# EAGLE schematic BikeBikeAja|V2 (EAGLE 9.6.2)

## Sheet 1 of 4
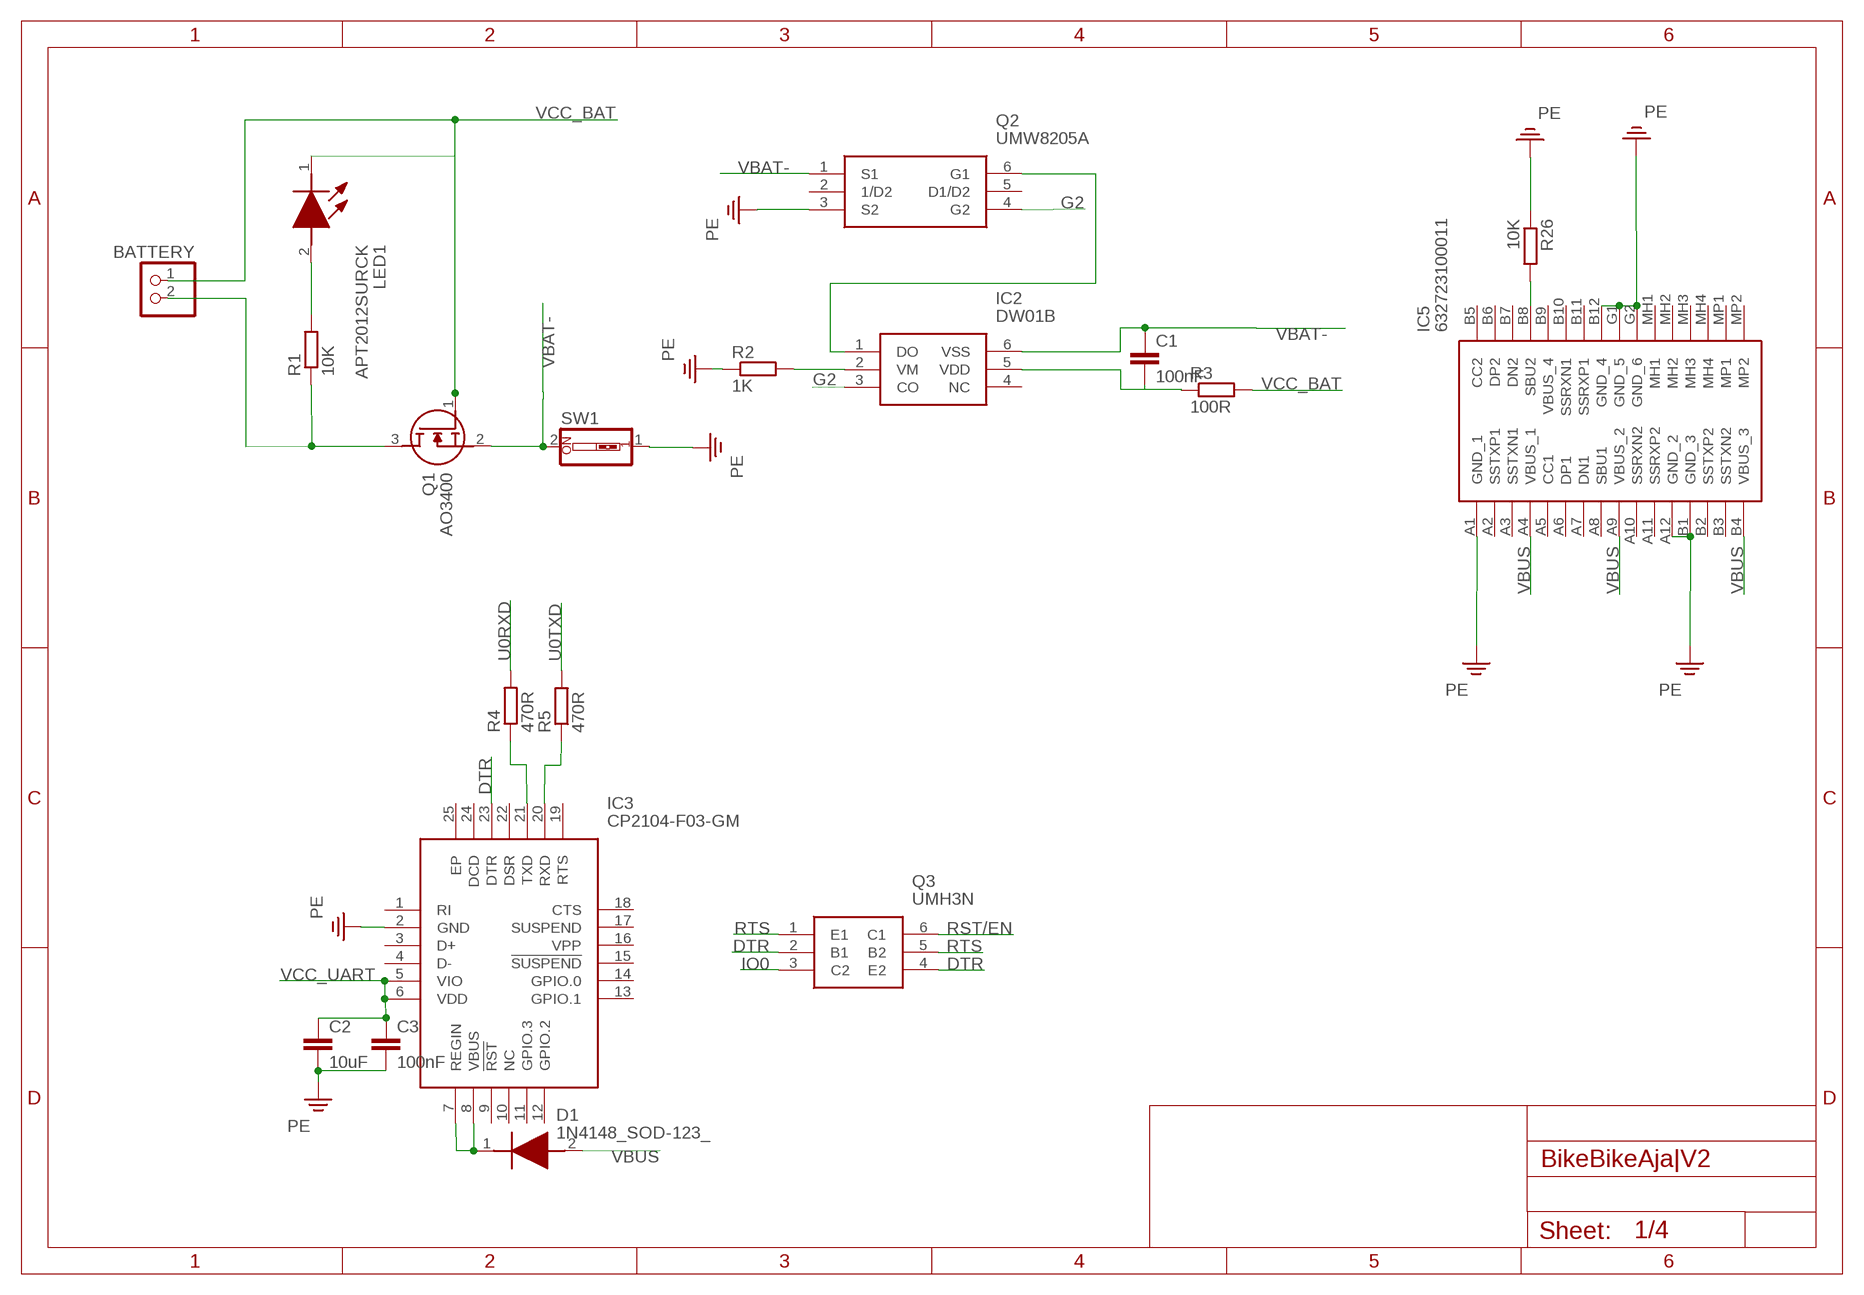
[diagram p0: schematic, sheet 1]

### Parts
BATTERY  PINHD-1X2  [1X02]
C1  100nF  C-EUC1206  [C1206]
C2  10uF  C-EUC1206  [C1206]
C3  100nF  C-EUC1206  [C1206]
D1  1N4148_SOD-123_  [SOD3716X135N]
IC2  DW01B  [SOT95P280X145-6N]
IC3  CP2104-F03-GM  [QFN50P400X400X80-25N]
IC5  632723100011  [632723100011]
LED1  APT2012SURCK  [LEDC2012X85N]
Q1  AO3400  [SOT95P280X125-3N]
Q2  UMW8205A  [SOT95P285X140-6N]
Q3  UMH3N  [SOT65P230X110-6N]
R1  10K  R-EU_R0805  [R0805]
R2  1K  R-EU_R0805  [R0805]
R3  100R  R-EU_R0805  [R0805]
R4  470R  R-EU_R0805  [R0805]
R5  470R  R-EU_R0805  [R0805]
R26  10K  R-EU_R0805  [R0805]
SW1  SW_DIP-1  [EDG-01]

### Nets
DTR: IC3.23(DTR) Q3.2(B1) Q3.4(E2)
G2: IC2.3(CO) Q2.4(G2)
IO0: Q3.3(C2) ; also sheet 3
N$1: LED1.2(A) R1.2
N$2: BATTERY.1 LED1.1(K) Q1.1(G)
N$3: BATTERY.2 Q1.3(D) R1.1
N$4: Q1.2(S) SW1.2
N$5: IC2.1(DO) Q2.6(G1)
N$6: C1.1 IC2.6(VSS)
N$7: C1.2 IC2.5(VDD) R3.1
N$9: IC2.2(VM) R2.2
N$10: D1.1(K) IC3.7(REGIN) IC3.8(VBUS)
N$11: IC3.21(TXD) R4.1
N$12: IC3.20(RXD) R5.1
N$14: IC5.B8(SBU2) R26.2
PE: C2.2 C3.2 IC3.2(GND) IC5.A1(GND_1) IC5.A12(GND_2) IC5.B1(GND_3) IC5.B12(GND_4) IC5.G1(GND_5) IC5.G2(GND_6) Q2.3(S2) R2.1 R26.1 SW1.1 ; also sheet 2,3,4
RST/EN: Q3.6(C1) ; also sheet 3
RTS: Q3.1(E1) Q3.5(B2)
U0RXD: R4.2 ; also sheet 3
U0TXD: R5.2 ; also sheet 3
VBAT-: Q2.1(S1)
VBUS: D1.2(A) IC5.A4(VBUS_1) IC5.A9(VBUS_2) IC5.B4(VBUS_3) ; also sheet 4
VCC_BAT: R3.2
VCC_UART: C2.1 C3.1 IC3.5(VIO) IC3.6(VDD)
Unconnected: IC2.4(NC) IC3.1(RI) IC3.3(D+) IC3.4(D-) IC3.9(!RST) IC3.10(NC) IC3.11(GPIO.3) IC3.12(GPIO.2) IC3.13(GPIO.1) IC3.14(GPIO.0) IC3.15(!SUSPEND) IC3.16(VPP) IC3.17(SUSPEND) IC3.18(CTS) IC3.19(RTS) IC3.22(DSR) IC3.24(DCD) IC3.25(EP) IC5.A2(SSTXP1) IC5.A3(SSTXN1) IC5.A5(CC1) IC5.A6(DP1) IC5.A7(DN1) IC5.A8(SBU1) IC5.A10(SSRXN2) IC5.A11(SSRXP2) IC5.B2(SSTXP2) IC5.B3(SSTXN2) IC5.B5(CC2) IC5.B6(DP2) IC5.B7(DN2) IC5.B9(VBUS_4) IC5.B10(SSRXN1) IC5.B11(SSRXP1) IC5.MH1 IC5.MH2 IC5.MH3 IC5.MH4 IC5.MP1 IC5.MP2 Q2.2(1/D2) Q2.5(D1/D2)

## Sheet 2 of 4
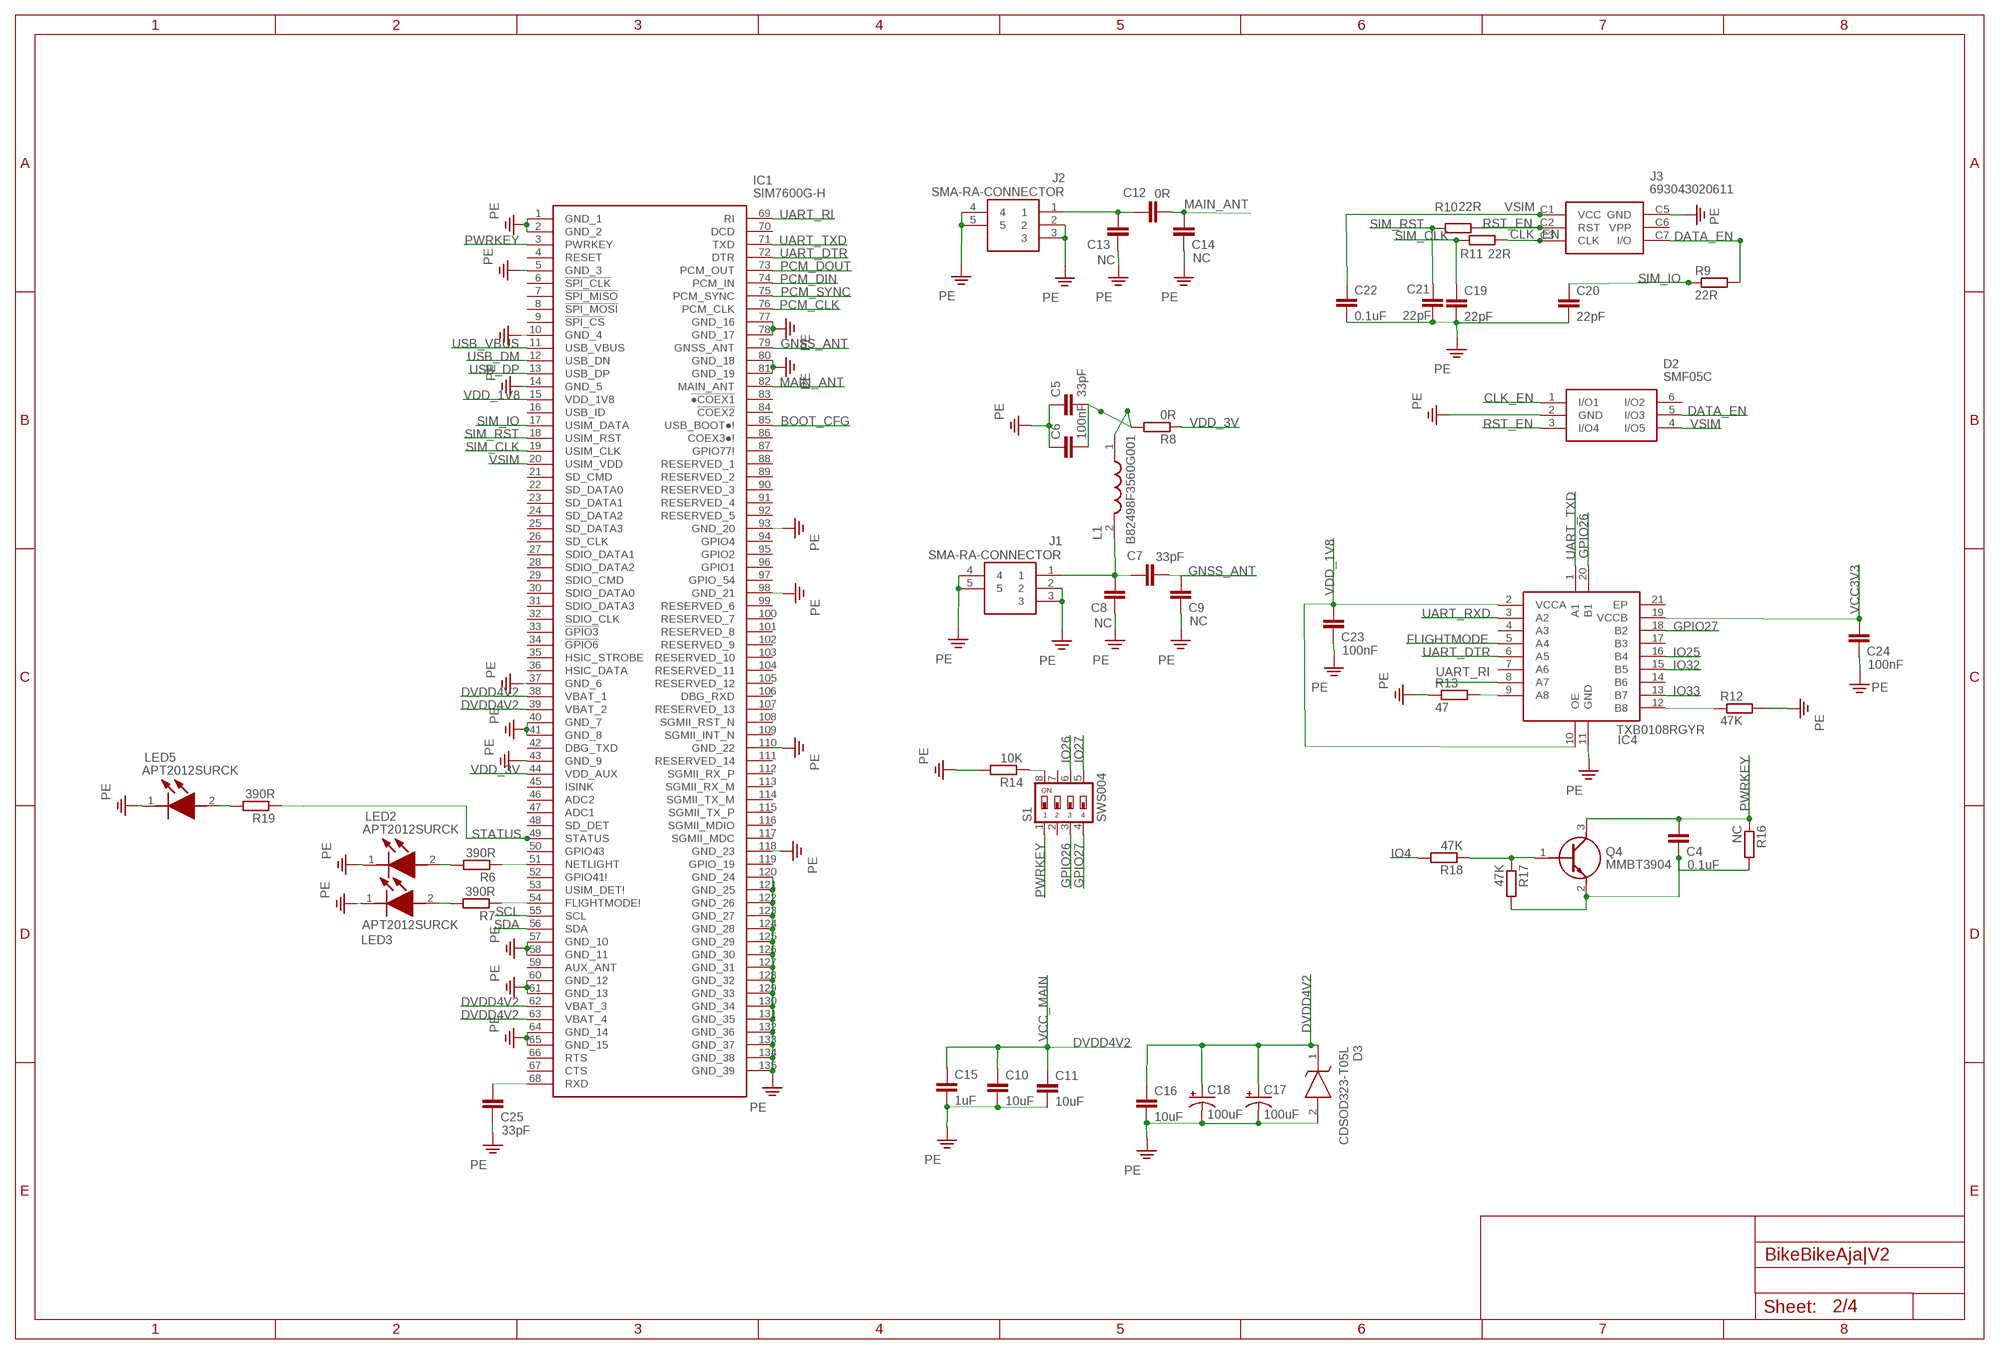
[diagram p1: schematic, sheet 2]

### Parts
C4  0.1uF  C-EUC1206  [C1206]
C5  33pF  C-EUC1206  [C1206]
C6  100nF  C-EUC1206  [C1206]
C7  33pF  C-EUC1206  [C1206]
C8  NC  C-EUC1206  [C1206]
C9  NC  C-EUC1206  [C1206]
C10  10uF  C-EUC1206  [C1206]
C11  10uF  C-EUC1206  [C1206]
C12  0R  C-EUC1206  [C1206]
C13  NC  C-EUC1206  [C1206]
C14  NC  C-EUC1206  [C1206]
C15  1uF  C-EUC1206  [C1206]
C16  10uF  C-EUC1206  [C1206]
C17  100uF  CPOL-USA/3216-18W  [A/3216-18W]
C18  100uF  CPOL-USA/3216-18W  [A/3216-18W]
C19  22pF  C-EUC1206  [C1206]
C20  22pF  C-EUC1206  [C1206]
C21  22pF  C-EUC1206  [C1206]
C22  0.1uF  C-EUC1206  [C1206]
C23  100nF  C-EUC1206  [C1206]
C24  100nF  C-EUC1206  [C1206]
C25  33pF  C-EUC1206  [C1206]
D2  SMF05C  [SOT65P210X110-6N]
D3  CDSOD323-T05L  [SOD2513X114N]
IC1  SIM7600G-H  [SIM7600GH]
IC4  TXB0108RGYR  [SN74LVC541ARGYR]
J1  SMA-RA-CONNECTOR  [SMARACONNECTOR]
J2  SMA-RA-CONNECTOR  [SMARACONNECTOR]
J3  693043020611  [693043020611]
L1  B82498F3560G001  [B82498F]
LED2  APT2012SURCK  [LEDC2012X85N]
LED3  APT2012SURCK  [LEDC2012X85N]
LED5  APT2012SURCK  [LEDC2012X85N]
Q4  MMBT3904  [SOT95P240X120-3N]
R6  390R  R-EU_R0805  [R0805]
R7  390R  R-EU_R0805  [R0805]
R8  0R  R-EU_R0805  [R0805]
R9  22R  R-EU_R0805  [R0805]
R10  22R  R-EU_R0805  [R0805]
R11  22R  R-EU_R0805  [R0805]
R12  47K  R-EU_R0805  [R0805]
R13  47  R-EU_R0805  [R0805]
R14  10K  R-EU_R0805  [R0805]
R16  NC  R-EU_R0805  [R0805]
R17  47K  R-EU_R0805  [R0805]
R18  47K  R-EU_R0805  [R0805]
R19  390R  R-EU_R0805  [R0805]
S1  SWS004  [SMS-004]

### Nets
BOOT_CFG: IC1.85(USB_BOOT●!)
CLK_EN: D2.1(I/O1) J3.C3(CLK) R11.1
DATA_EN: D2.5(I/O3) J3.C7(I/O)
DVDD4V2: IC1.38(VBAT_1) IC1.39(VBAT_2) IC1.62(VBAT_3) IC1.63(VBAT_4) ; also sheet 4
FLIGHTMODE: IC4.5(A4)
GNSS_ANT: IC1.79(GNSS_ANT)
GPIO26: IC4.20(B1) S1.3
GPIO27: IC4.18(B2) S1.4
IO4: R18.2 ; also sheet 3
IO25: IC4.16(B4) ; also sheet 3
IO26: S1.6 ; also sheet 3
IO27: S1.5 ; also sheet 3
IO32: IC4.15(B5) ; also sheet 3
IO33: IC4.13(B7) ; also sheet 3
MAIN_ANT: C12.2 C14.2 IC1.82(MAIN_ANT)
N$20: IC1.51(NETLIGHT) R6.1
N$21: LED2.2(A) R6.2
N$22: LED3.2(A) R7.2
N$23: IC1.54(FLIGHTMODE!) R7.1
N$24: C5.1 C6.1
N$26: C5.2 C6.2 L1.1 R8.2
N$28: C7.1 C8.2 J1.1 L1.2
N$29: C7.2 C9.2
N$30: C10.1 C11.1 C15.1
N$31: R9.2
N$32: C16.1 C17.+ C18.+ D3.1(K)
N$34: C12.1 C13.2 J2.1
N$35: IC4.12(B8) R12.1
N$36: IC4.9(A8) R13.2
N$37: R14.1 S1.8
N$39: C25.2 IC1.68(RXD)
N$40: Q4.1(B) R17.1 R18.1
N$41: C4.1 Q4.2(E) R16.2 R17.2
N$42: LED5.2(A) R19.2
PCM_CLK: IC1.76(PCM_CLK)
PCM_DIN: IC1.74(PCM_IN)
PCM_DOUT: IC1.73(PCM_OUT)
PCM_SYNC: IC1.75(PCM_SYNC)
PE: C8.1 C9.1 C10.2 C11.2 C13.1 C14.1 C15.2 C16.2 C17.- C18.- C19.2 C20.2 C21.2 C22.2 C23.1 C24.1 C25.1 D2.2(GND) D3.2(A) IC1.1(GND_1) IC1.2(GND_2) IC1.5(GND_3) IC1.10(GND_4) IC1.14(GND_5) IC1.37(GND_6) IC1.40(GND_7) IC1.41(GND_8) IC1.43(GND_9) IC1.57(GND_10) IC1.58(GND_11) IC1.60(GND_12) IC1.61(GND_13) IC1.64(GND_14) IC1.65(GND_15) IC1.77(GND_16) IC1.78(GND_17) IC1.80(GND_18) IC1.81(GND_19) IC1.93(GND_20) IC1.98(GND_21) IC1.110(GND_22) IC1.118(GND_23) IC1.120(GND_24) IC1.121(GND_25) IC1.122(GND_26) IC1.123(GND_27) IC1.124(GND_28) IC1.125(GND_29) IC1.126(GND_30) IC1.127(GND_31) IC1.128(GND_32) IC1.129(GND_33) IC1.130(GND_34) IC1.131(GND_35) IC1.132(GND_36) IC1.133(GND_37) IC1.134(GND_38) IC1.135(GND_39) IC4.11(GND) J1.2 J1.3 J1.4 J1.5 J2.2 J2.3 J2.4 J2.5 J3.C5(GND) LED2.1(K) LED3.1(K) LED5.1(K) R12.2 R13.1 R14.2 ; also sheet 1,3,4
PWRKEY: C4.2 IC1.3(PWRKEY) Q4.3(C) R16.1 S1.1
RST_EN: D2.3(I/O4) J3.C2(RST) R10.1
SCL: IC1.55(SCL)
SDA: IC1.56(SDA)
SIM_CLK: C19.1 IC1.19(USIM_CLK) R11.2
SIM_IO: C20.1 IC1.17(USIM_DATA) R9.1
SIM_RST: C21.1 IC1.18(USIM_RST) R10.2
STATUS: IC1.49(STATUS) R19.1
UART_DTR: IC1.72(DTR) IC4.6(A5)
UART_RI: IC1.69(RI) IC4.8(A7)
UART_RXD: IC4.3(A2)
UART_TXD: IC1.71(TXD) IC4.1(A1)
USB_DM: IC1.12(USB_DN)
USB_DP: IC1.13(USB_DP)
USB_VBUS: IC1.11(USB_VBUS)
VCC3V3: C24.2 IC4.19(VCCB) ; also sheet 3,4
VDD_1V8: C23.2 IC1.15(VDD_1V8) IC4.2(VCCA) IC4.10(OE)
VDD_3V: IC1.44(VDD_AUX) R8.1
VSIM: C22.1 D2.4(I/O5) IC1.20(USIM_VDD) J3.C1(VCC)
Unconnected: D2.6(I/O2) IC1.4(RESET) IC1.6(!SPI_CLK) IC1.7(!SPI_MISO) IC1.8(!SPI_MOSI) IC1.9(!SPI_CS) IC1.16(USB_ID) IC1.21(SD_CMD) IC1.22(SD_DATA0) IC1.23(SD_DATA1) IC1.24(SD_DATA2) IC1.25(SD_DATA3) IC1.26(SD_CLK) IC1.27(SDIO_DATA1) IC1.28(SDIO_DATA2) IC1.29(SDIO_CMD) IC1.30(SDIO_DATA0) IC1.31(SDIO_DATA3) IC1.32(SDIO_CLK) IC1.33(!GPIO3) IC1.34(!GPIO6) IC1.35(HSIC_STROBE) IC1.36(HSIC_DATA) IC1.42(DBG_TXD) IC1.45(ISINK) IC1.46(ADC2) IC1.47(ADC1) IC1.48(SD_DET) IC1.50(GPIO43) IC1.52(GPIO41!) IC1.53(USIM_DET!) IC1.59(AUX_ANT) IC1.66(RTS) IC1.67(CTS) IC1.70(DCD) IC1.83(!●COEX1) IC1.84(!COEX2) IC1.86(COEX3●!) IC1.87(GPIO77!) IC1.88(RESERVED_1) IC1.89(RESERVED_2) IC1.90(RESERVED_3) IC1.91(RESERVED_4) IC1.92(RESERVED_5) IC1.94(GPIO4) IC1.95(GPIO2) IC1.96(GPIO1) IC1.97(GPIO_54) IC1.99(RESERVED_6) IC1.100(RESERVED_7) IC1.101(RESERVED_8) IC1.102(RESERVED_9) IC1.103(RESERVED_10) IC1.104(RESERVED_11) IC1.105(RESERVED_12) IC1.106(DBG_RXD) IC1.107(RESERVED_13) IC1.108(SGMII_RST_N) IC1.109(SGMII_INT_N) IC1.111(RESERVED_14) IC1.112(SGMII_RX_P) IC1.113(SGMII_RX_M) IC1.114(SGMII_TX_M) IC1.115(SGMII_TX_P) IC1.116(SGMII_MDIO) IC1.117(SGMII_MDC) IC1.119(GPIO_19) IC4.4(A3) IC4.7(A6) IC4.14(B6) IC4.17(B3) IC4.21(EP) J3.C6(VPP) S1.2 S1.7

## Sheet 3 of 4
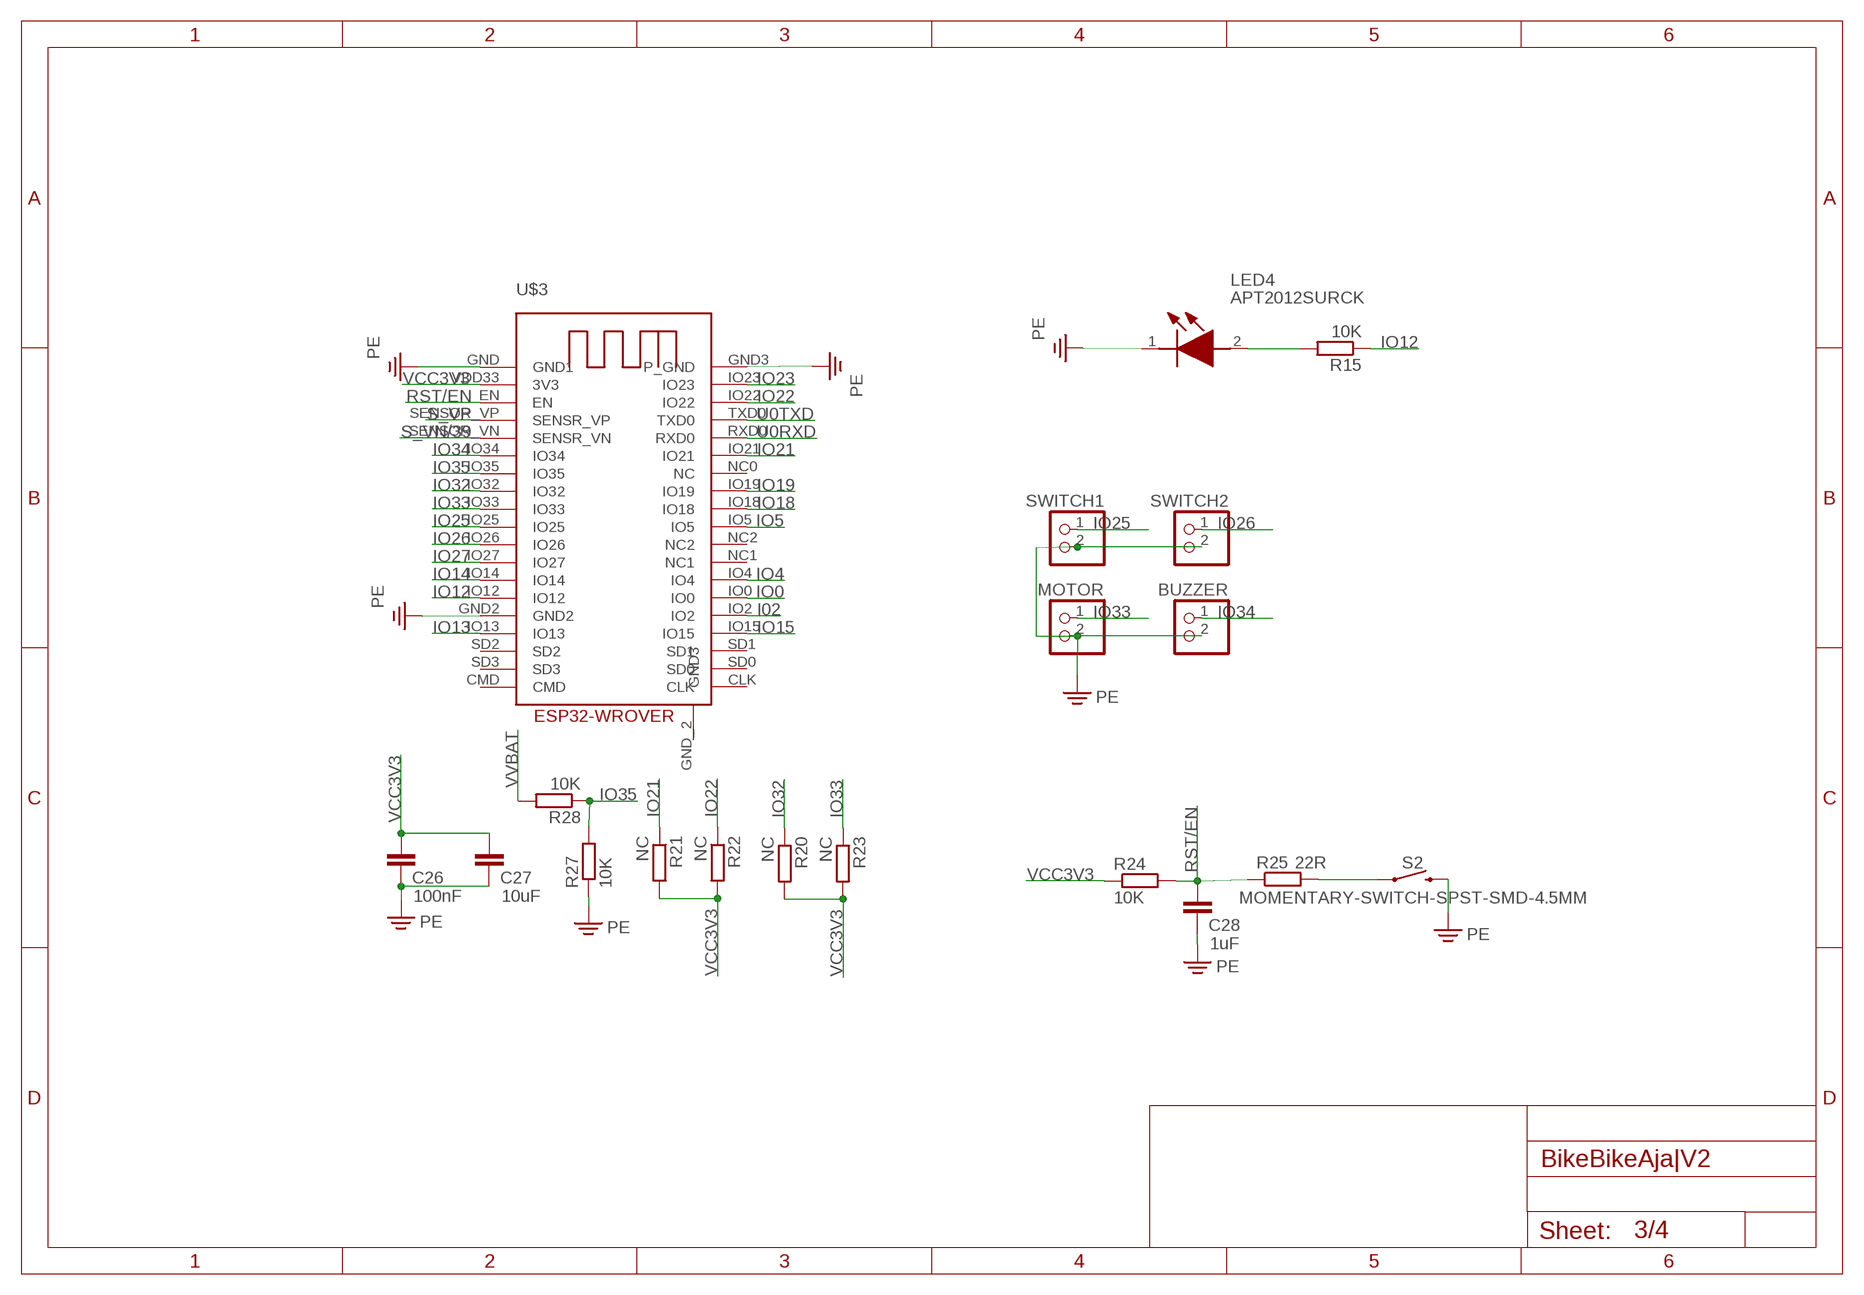
[diagram p2: schematic, sheet 3]

### Parts
BUZZER  PINHD-1X2  [1X02]
C26  100nF  C-EUC1206  [C1206]
C27  10uF  C-EUC1206  [C1206]
C28  1uF  C-EUC1206  [C1206]
LED4  APT2012SURCK  [LEDC2012X85N]
MOTOR  PINHD-1X2  [1X02]
R15  10K  R-EU_R0805  [R0805]
R20  NC  R-EU_R0805  [R0805]
R21  NC  R-EU_R0805  [R0805]
R22  NC  R-EU_R0805  [R0805]
R23  NC  R-EU_R0805  [R0805]
R24  10K  R-EU_R0805  [R0805]
R25  22R  R-EU_R0805  [R0805]
R27  10K  R-EU_R0805  [R0805]
R28  10K  R-EU_R0805  [R0805]
S2  MOMENTARY-SWITCH-SPST-SMD-4.5MM  [TACTILE_SWITCH_SMD_4.5MM]
SWITCH1  PINHD-1X2  [1X02]
SWITCH2  PINHD-1X2  [1X02]
U$3  ESP32-WROVER  [ESP32-WROVER]

### Nets
I02: U$3.IO2
IO0: U$3.IO0 ; also sheet 1
IO4: U$3.IO4 ; also sheet 2
IO5: U$3.IO5
IO12: R15.1 U$3.IO12
IO13: U$3.IO13
IO14: U$3.IO14
IO15: U$3.IO15
IO18: U$3.IO18
IO19: U$3.IO19
IO21: R21.1 U$3.IO21
IO22: R22.1 U$3.IO22
IO23: U$3.IO23
IO25: SWITCH1.1 U$3.IO25 ; also sheet 2
IO26: SWITCH2.1 U$3.IO26 ; also sheet 2
IO27: U$3.IO27 ; also sheet 2
IO32: R20.1 U$3.IO32 ; also sheet 2
IO33: MOTOR.1 R23.1 U$3.IO33 ; also sheet 2
IO34: BUZZER.1 U$3.IO34
IO35: R27.2 R28.1 U$3.IO35
N$13: R25.2 S2.2 S2.3
N$38: LED4.2(A) R15.2
PE: BUZZER.2 C26.1 C27.1 C28.1 LED4.1(K) MOTOR.2 R27.1 S2.1 S2.4 SWITCH1.2 SWITCH2.2 U$3.GND2 U$3.GND3(P_GND) U$3.GND(GND1) ; also sheet 1,2,4
RST/EN: C28.2 R24.2 R25.1 U$3.EN ; also sheet 1
S_VN/39: U$3.SENSOR_VN(SENSR_VN)
S_VP: U$3.SENSOR_VP(SENSR_VP)
U0RXD: U$3.RXD0 ; also sheet 1
U0TXD: U$3.TXD0 ; also sheet 1
VCC3V3: C26.2 C27.2 R20.2 R21.2 R22.2 R23.2 R24.1 U$3.VDD33(3V3) ; also sheet 2,4
VVBAT: R28.2 ; also sheet 4
Unconnected: U$3.CLK U$3.CMD U$3.GND_2(GND3) U$3.NC0(NC) U$3.NC1 U$3.NC2 U$3.SD0 U$3.SD1 U$3.SD2 U$3.SD3

## Sheet 4 of 4
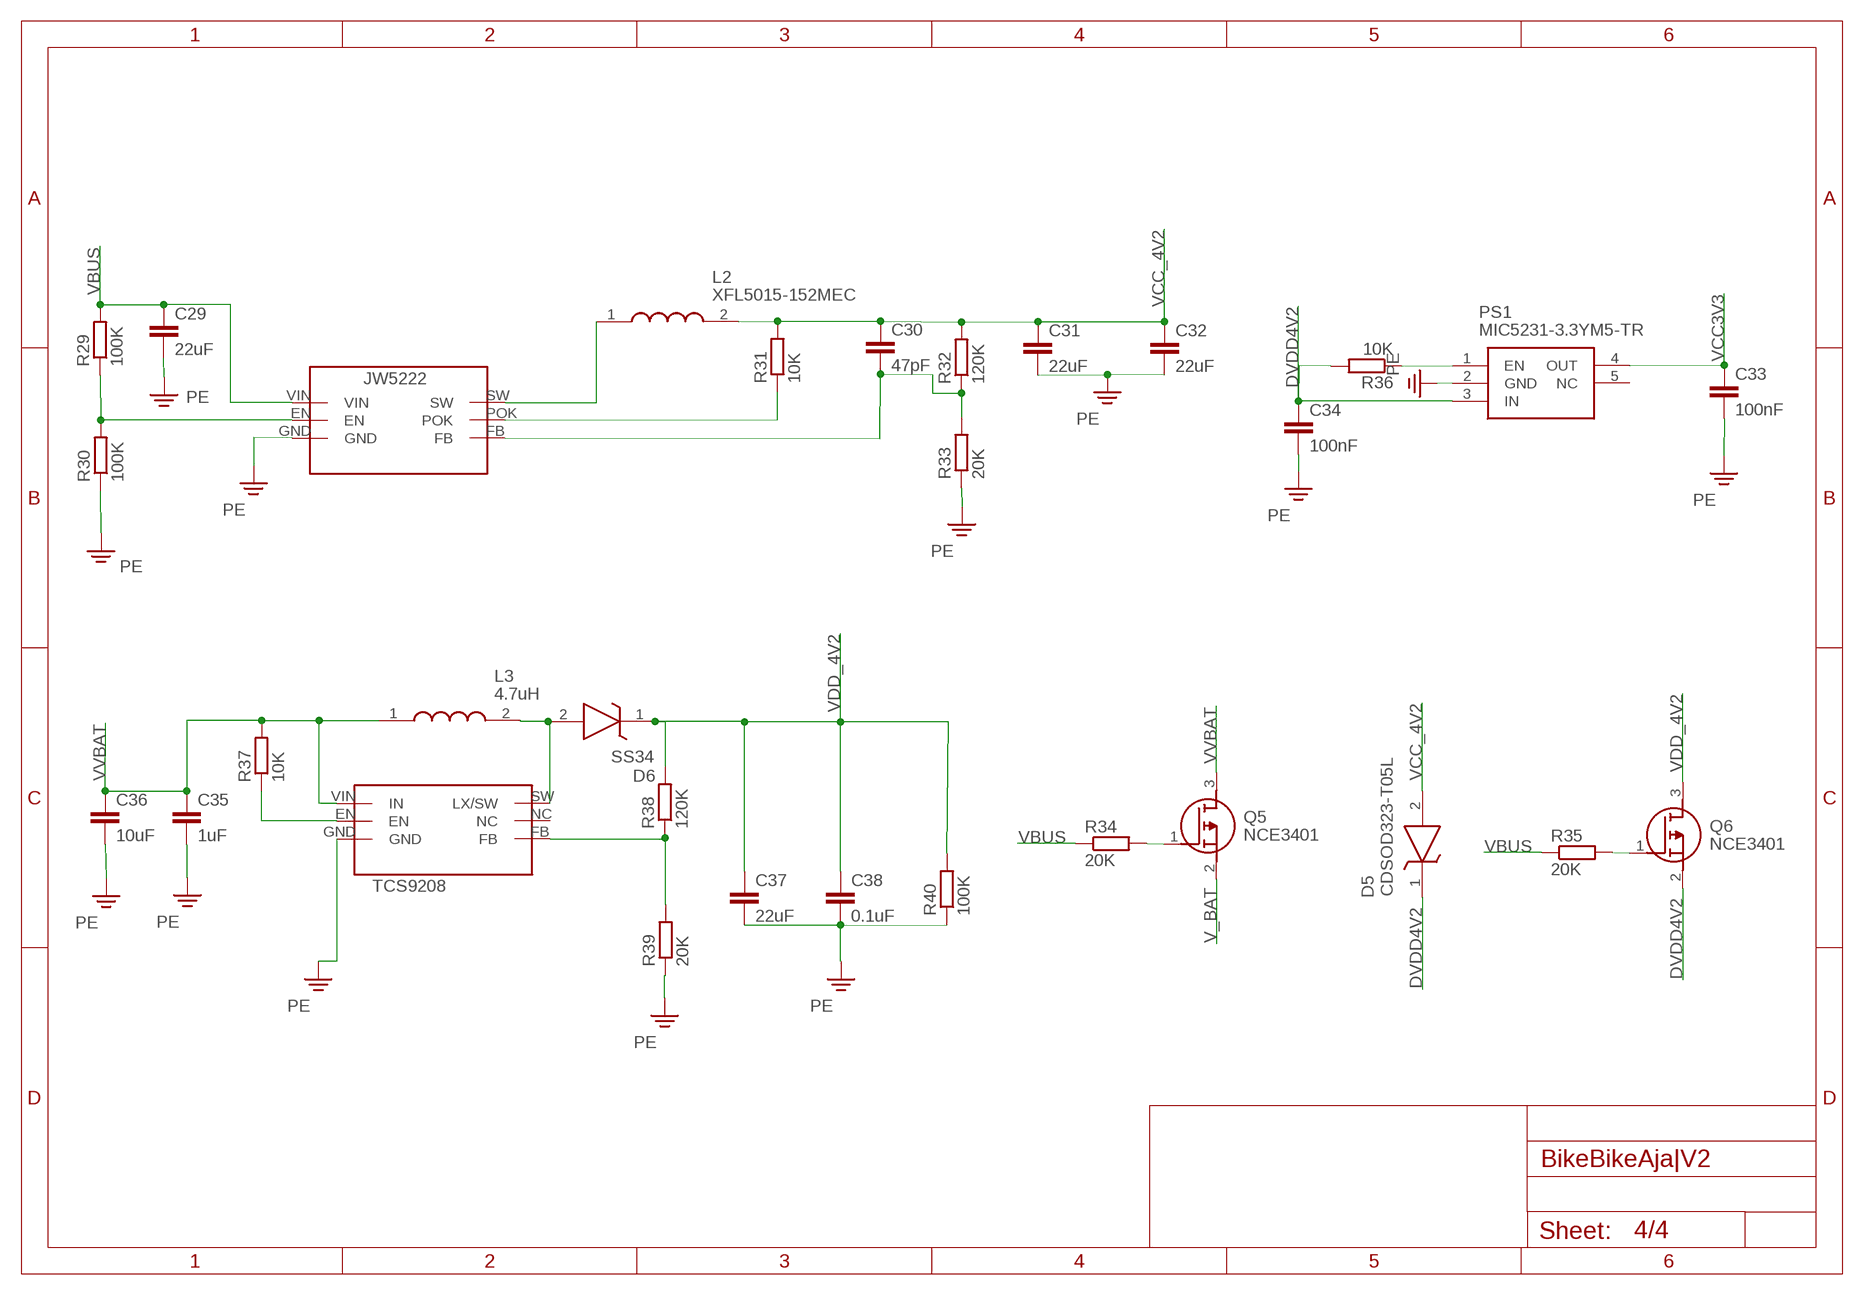
[diagram p3: schematic, sheet 4]

### Parts
C29  22uF  C-EUC1206  [C1206]
C30  47pF  C-EUC1206  [C1206]
C31  22uF  C-EUC1206  [C1206]
C32  22uF  C-EUC1206  [C1206]
C33  100nF  C-EUC1206  [C1206]
C34  100nF  C-EUC1206  [C1206]
C35  1uF  C-EUC1206  [C1206]
C36  10uF  C-EUC1206  [C1206]
C37  22uF  C-EUC1206  [C1206]
C38  0.1uF  C-EUC1206  [C1206]
D5  CDSOD323-T05L  [SOD2513X114N]
D6  SS34  CDSOD323-T05L  [SOD2513X114N]
L2  XFL5015-152MEC  [XFL5015152MEC]
L3  4.7uH  XFL5015-152MEC  [XFL5015152MEC]
PS1  MIC5231-3.3YM5-TR  [SOT95P280X145-5N]
Q5  NCE3401  [SOT95P240X115-3N]
Q6  NCE3401  [SOT95P240X115-3N]
R29  100K  R-EU_R0805  [R0805]
R30  100K  R-EU_R0805  [R0805]
R31  10K  R-EU_R0805  [R0805]
R32  120K  R-EU_R0805  [R0805]
R33  20K  R-EU_R0805  [R0805]
R34  20K  R-EU_R0805  [R0805]
R35  20K  R-EU_R0805  [R0805]
R36  10K  R-EU_R0805  [R0805]
R37  10K  R-EU_R0805  [R0805]
R38  120K  R-EU_R0805  [R0805]
R39  20K  R-EU_R0805  [R0805]
R40  100K  R-EU_R0805  [R0805]
U$1  JW5222  [JW5222]
U$4  TCS9208  [TCS9208]

### Nets
DVDD4V2: C34.1 D5.1(K) PS1.3(IN) Q6.2(S) R36.2 ; also sheet 2
N$15: R29.1 R30.2 U$1.EN
N$16: L2.1 U$1.SW
N$17: R31.1 U$1.POK
N$18: Q5.1(G) R34.2
N$19: C30.2 R32.1 R33.2 U$1.FB
N$43: Q6.1(G) R35.2
N$44: PS1.1(EN) R36.1
N$45: D6.2(A) L3.2 U$4.SW(LX/SW)
N$46: R37.1 U$4.EN
N$47: U$4.VIN(IN)
N$48: R38.1 R39.2 U$4.FB
PE: C29.2 C31.2 C32.2 C33.2 C34.2 C35.2 C36.2 C37.2 C38.2 PS1.2(GND) R30.1 R33.1 R39.1 R40.1 U$1.GND U$4.GND ; also sheet 1,2,3
V_BAT: Q5.2(S)
VBUS: C29.1 R29.2 R34.1 R35.1 U$1.VIN ; also sheet 1
VCC3V3: C33.1 PS1.4(OUT) ; also sheet 2,3
VCC_4V2: C30.1 C31.1 C32.1 D5.2(A) L2.2 R31.2 R32.2
VDD_4V2: C37.1 C38.1 D6.1(K) Q6.3(D) R38.2 R40.2
VVBAT: C35.1 C36.1 L3.1 Q5.3(D) R37.2 ; also sheet 3
Unconnected: PS1.5(NC) U$4.NC

## Library data of the parts
BATTERY BUZZER MOTOR SWITCH1 SWITCH2 = pinhead:PINHD-1X2: PIN HEADER
C1-C16 C19-C38 = rcl:C-EU: CAPACITOR, European symbol; SPICEPREFIX: C
C17 C18 = rcl:CPOL-US: POLARIZED CAPACITOR, American symbol; SPICEPREFIX: C
D1 = 1N4148_SOD-123_:1N4148_SOD-123_: Small Signal Fast Switching Diode Source: Datasheet <https://docs.rs-online.com/d6a2/0900766b80df8fd1.pdf>; DESCRIPTION: Small Signal Fast Switching Diode; HEIGHT: 1.35mm; MANUFACTURER_NAME: Vishay; MANUFACTURER_PART_NUMBER: 1N4148(SOD-123)
D2 = SMF05C:SMF05C: SEMTECH - SMF05C - DIODE, TVS, 5 CH, BIDIR, 5V, SC70 Source: Datasheet <https://componentsearchengine.com/Datasheets/2/SMF05C.pdf>; DESCRIPTION: SEMTECH - SMF05C - DIODE, TVS, 5 CH, BIDIR, 5V, SC70; HEIGHT: 1.1mm; MANUFACTURER_NAME: SEMTECH; MANUFACTURER_PART_NUMBER: SMF05C
D3 D5 D6 = CDSOD323-T05L:CDSOD323-T05L: ESD Suppressors / TVS Diodes Unidirectional Ultra Low Cap Source: Datasheet <https://www.bourns.com/docs/Product-Datasheets/CDSOD323-TxxLC.pdf>; ARROW_PART_NUMBER: CDSOD323-T05L; ARROW_PRICE-STOCK: https://www.arrow.com/en/products/cdsod323-t05l/bourns?region=nac; DESCRIPTION: ESD Suppressors / TVS Diodes Unidirectional Ultra Low Cap; HEIGHT: 1.14mm; MANUFACTURER_NAME: Bourns; MANUFACTURER_PART_NUMBER: CDSOD323-T05L; MOUSER_PART_NUMBER: 652-CDSOD323-T05L; MOUSER_PRICE-STOCK: https://www.mouser.co.uk/ProductDetail/Bourns/CDSOD323-T05L?qs=6S5Watp5UnKSlOuqhhas9Q%3D%3D
IC1 = SIM7600G-H:SIM7600G-H: LTE-FDD/LTE TDD/HSPA+/UMTS/EDGE/GPRS/GSM module solution Source: Datasheet <https://www.waveshare.com/w/upload/e/e6/SIM7600G_SIM7600G-H_Hardware_Design_V1.00.pdf>; DESCRIPTION: LTE-FDD/LTE TDD/HSPA+/UMTS/EDGE/GPRS/GSM module solution; HEIGHT: 3.1mm; MANUFACTURER_NAME: SIMCOM; MANUFACTURER_PART_NUMBER: SIM7600G-H
IC2 = DW01B:DW01B: Battery Protection ICs SOT-23-6 RoHS Source: Datasheet <https://datasheet.lcsc.com/szlcsc/BLUE-ROCKET-DW01B_C305480.pdf>; DESCRIPTION: Battery Protection ICs SOT-23-6 RoHS; HEIGHT: 1.45mm; MANUFACTURER_NAME: Foshan Blue Rocket Elec; MANUFACTURER_PART_NUMBER: DW01B
IC3 = CP2104-F03-GM:CP2104-F03-GM: USB-to-UART Bridge,2Mbps,OTP,QFN24 Silicon Labs CP2104-F03-GM, USB Controller, 12MBps, USB to UART, 3 3.6 V, 24-Pin QFN Source: Datasheet <https://www.silabs.com/Support Documents/TechnicalDocs/cp2104.pdf>; ARROW_PART_NUMBER: CP2104-F03-GM; ARROW_PRICE-STOCK: https://www.arrow.com/en/products/cp2104-f03-gm/silicon-labs?region=nac; DESCRIPTION: USB-to-UART Bridge,2Mbps,OTP,QFN24 Silicon Labs CP2104-F03-GM, USB Controller, 12MBps, USB to UART, 3 3.6 V, 24-Pin QFN; HEIGHT: 0.8mm; MANUFACTURER_NAME: Silicon Labs; MANUFACTURER_PART_NUMBER: CP2104-F03-GM; MOUSER_PART_NUMBER: 634-CP2104-F03-GM; MOUSER_PRICE-STOCK: https://www.mouser.co.uk/ProductDetail/Silicon-Labs/CP2104-F03-GM?qs=j12q4iUN960zrcKDk%2FjKbw%3D%3D
IC4 = TXB0108RGYR:TXB0108RGYR: 8-Bit Bidirectional Voltage-Level Shifter with Auto Direction Sensing and +/-15-kV ESD Protect Source: Datasheet <http://www.ti.com/lit/gpn/txb0108>; ARROW_PART_NUMBER: TXB0108RGYR; ARROW_PRICE-STOCK: https://www.arrow.com/en/products/txb0108rgyr/texas-instruments?region=nac; DESCRIPTION: 8-Bit Bidirectional Voltage-Level Shifter with Auto Direction Sensing and +/-15-kV ESD Protect; HEIGHT: 1mm; MANUFACTURER_NAME: Texas Instruments; MANUFACTURER_PART_NUMBER: TXB0108RGYR; MOUSER_PART_NUMBER: 595-TXB0108RGYR; MOUSER_PRICE-STOCK: https://www.mouser.co.uk/ProductDetail/Texas-Instruments/TXB0108RGYR?qs=oFXvjAmG9EjlwpBG6jCg6w%3D%3D
IC5 = 632723100011:632723100011: WURTH ELEKTRONIK - 632723100011 - USB Connector, USB Type C, USB 3.1, Receptacle, 24 Ways, Surface Mount, Through Hole Mount Source: Datasheet <https://componentsearchengine.com/Datasheets/1/632723100011.pdf>; DESCRIPTION: WURTH ELEKTRONIK - 632723100011 - USB Connector, USB Type C, USB 3.1, Receptacle, 24 Ways, Surface Mount, Through Hole Mount; HEIGHT: 3.11mm; MANUFACTURER_NAME: Wurth Elektronik; MANUFACTURER_PART_NUMBER: 632723100011; MOUSER_PART_NUMBER: 710-632723100011; MOUSER_PRICE-STOCK: https://www.mouser.co.uk/ProductDetail/Wurth-Elektronik/632723100011?qs=NK6InXoXhq4o62C9ULXLjQ%3D%3D
J1 J2 = SMA-RA-CONNECTOR:SMA-RA-CONNECTOR: SMA R/A Connector Source: Datasheet; DESCRIPTION: SMA R/A Connector; HEIGHT: 9mm; MANUFACTURER_NAME: LPRS; MANUFACTURER_PART_NUMBER: SMA-RA-CONNECTOR
J3 = 693043020611:693043020611: Memory Card Connectors WR-CRD Nano SIM SMT 1.2mm Push/Pull Source: Datasheet <http://katalog.we-online.de/em/datasheet/693043020611.pdf>; DESCRIPTION: Memory Card Connectors WR-CRD Nano SIM SMT 1.2mm Push/Pull; HEIGHT: mm; MANUFACTURER_NAME: Wurth Elektronik; MANUFACTURER_PART_NUMBER: 693043020611; MOUSER_PART_NUMBER: 710-693043020611; MOUSER_PRICE-STOCK: https://www.mouser.co.uk/ProductDetail/Wurth-Elektronik/693043020611?qs=a9WhcLg8qCwC%2FpVEDAdA2Q%3D%3D
L1 = B82498F3560G001:B82498F3560G001: SMD / SMT Inductors (Coils), L=0.056uH, 2.0mm x 1.25mm [EIA 0805] Source: Datasheet <https://product.tdk.com/system/files/dam/doc/product/inductor/inductor/smd/data_sheet/30/db/ind_2008/b82498f3.pdf>; DESCRIPTION: SMD / SMT Inductors (Coils), L=0.056uH, 2.0mm x 1.25mm [EIA 0805]; HEIGHT: 1.4mm; MANUFACTURER_NAME: TDK; MANUFACTURER_PART_NUMBER: B82498F3560G001
L2 L3 = XFL5015-152MEC:XFL5015-152MEC: Fixed Inductors 1.5Uh Shld 8A 20.1mOhms AECQ2 Source: Datasheet <https://www.coilcraft.com/getmedia/5f7b596c-8f2f-415e-931e-74a5b6804936/xfl5015.pdf>; DESCRIPTION: Fixed Inductors 1.5Uh Shld 8A 20.1mOhms AECQ2; HEIGHT: 1.5mm; MANUFACTURER_NAME: COILCRAFT; MANUFACTURER_PART_NUMBER: XFL5015-152MEC
LED1-LED5 = APT2012SURCK:APT2012SURCK: Standard LEDs - SMD RED WATER CLEAR Source: Datasheet <http://www.kingbrightusa.com/images/catalog/SPEC/APT2012SURCK.pdf>; ARROW_PART_NUMBER: APT2012SURCK; ARROW_PRICE-STOCK: https://www.arrow.com/en/products/apt2012surck/kingbright?region=nac; DESCRIPTION: Standard LEDs - SMD RED WATER CLEAR; HEIGHT: 0.85mm; MANUFACTURER_NAME: Kingbright; MANUFACTURER_PART_NUMBER: APT2012SURCK; MOUSER_PART_NUMBER: 604-APT2012SURCK; MOUSER_PRICE-STOCK: https://www.mouser.co.uk/ProductDetail/Kingbright/APT2012SURCK?qs=85uWm5%252BqJhXV5L%2Fv9DFxnA%3D%3D
PS1 = MIC5231-3.3YM5-TR:MIC5231-3.3YM5-TR: 3V3 LDO Regulator Source: Datasheet <http://ww1.microchip.com/downloads/en/DeviceDoc/mic5231.pdf>; ARROW_PART_NUMBER: MIC5231-3.3YM5-TR; ARROW_PRICE-STOCK: https://www.arrow.com/en/products/mic5231-3.3ym5-tr/microchip-technology?region=nac; DESCRIPTION: 3V3 LDO Regulator; HEIGHT: 1.45mm; MANUFACTURER_NAME: Microchip; MANUFACTURER_PART_NUMBER: MIC5231-3.3YM5-TR; MOUSER_PART_NUMBER: 998-MIC5231-3.3YM5TR; MOUSER_PRICE-STOCK: https://www.mouser.co.uk/ProductDetail/Microchip-Technology-Atmel/MIC5231-3.3YM5-TR?qs=U6T8BxXiZAV4ViZFSz%252BC0A%3D%3D
Q1 = AO3400:AO3400: 30V N-Channel MOSFET Source: Datasheet <http://aosmd.com/res/data_sheets/AO3400.pdf>; ARROW_PART_NUMBER: AO3400; ARROW_PRICE-STOCK: https://www.arrow.com/en/products/ao3400/alpha-and-omega-semiconductor; DESCRIPTION: 30V N-Channel MOSFET; HEIGHT: 1.25mm; MANUFACTURER_NAME: Alpha & Omega Semiconductors; MANUFACTURER_PART_NUMBER: AO3400
Q2 = UMW8205A:UMW8205A: Dual N-Channel Enhancement Mode MOSFET Source: Datasheet <https://datasheet.lcsc.com/szlcsc/1904151404_Youtai-Semiconductor-Co-Ltd-UMW8205A_C351449.pdf>; DESCRIPTION: Dual N-Channel Enhancement Mode MOSFET; HEIGHT: 1.4mm; MANUFACTURER_NAME: UMW; MANUFACTURER_PART_NUMBER: UMW8205A
Q3 = UMH3N:UMH3N: 2 NPN pre-biased (Dual) 100mA 50V SC-70-6(SOT-363) Digital Transistors RoHS Source: Datasheet <https://datasheet.lcsc.com/szlcsc/Changjiang-Electronics-Tech-CJ-UMH3N_C62892.pdf>; DESCRIPTION: 2 NPN pre-biased (Dual) 100mA 50V SC-70-6(SOT-363) Digital Transistors RoHS; HEIGHT: 1.1mm; MANUFACTURER_NAME: Changjiang Electronics Tech (CJ); MANUFACTURER_PART_NUMBER: UMH3N
Q4 = MMBT3904:MMBT3904: Transistor GP BJT NPN 40V 0.2A SOT23 Fairchild MMBT3904 NPN Bipolar Transistor, 0.2 A, 40 V, 3-Pin SOT-23 Source: Datasheet <https://media.digikey.com/pdf/Data Sheets/ON Semiconductor PDFs/2N3904,MMBT3904,PZT3904.pdf>; ARROW_PART_NUMBER: MMBT3904; ARROW_PRICE-STOCK: https://www.arrow.com/en/products/mmbt3904/on-semiconductor; DESCRIPTION: Transistor GP BJT NPN 40V 0.2A SOT23 Fairchild MMBT3904 NPN Bipolar Transistor, 0.2 A, 40 V, 3-Pin SOT-23; HEIGHT: 1.2mm; MANUFACTURER_NAME: onsemi; MANUFACTURER_PART_NUMBER: MMBT3904; MOUSER_PART_NUMBER: 512-MMBT3904; MOUSER_PRICE-STOCK: https://www.mouser.co.uk/ProductDetail/ON-Semiconductor-Fairchild/MMBT3904?qs=UMEuL5FsraCg3xKjS4uBJQ%3D%3D
Q5 Q6 = NCE3401:NCE3401: MOSFET P Trench 30V 4.2A 1.3V @ 250uA 55 m @ 4.2A,10V SOT-23(SOT-23-3) RoHS Source: Datasheet <https://datasheet.lcsc.com/szlcsc/Wuxi-NCE-Power-Semiconductor-NCE3401_C113490.pdf>; DESCRIPTION: MOSFET P Trench 30V 4.2A 1.3V @ 250uA 55 m @ 4.2A,10V SOT-23(SOT-23-3) RoHS; HEIGHT: 1.15mm; MANUFACTURER_NAME: Wuxi NCE Power Semiconductor; MANUFACTURER_PART_NUMBER: NCE3401
R1-R40 = rcl:R-EU_: RESISTOR, European symbol; SPICEPREFIX: R
S1 = smd-special:SWS004: SMD Dip Switch 4 pol.
S2 = SparkFun-Switches:MOMENTARY-SWITCH-SPST: Momentary Switch (Pushbutton) - SPST Normally-open (NO) SPST momentary switches (buttons, pushbuttons). Variants PTH-12MM - 12mm square, through-hole Momentary Pushbutton Switch - 12mm Square <https://www.sparkfun.com/products/9190> (COM-09190) PTH-6.0MM, PTH-6.0MM-KIT - 6.0mm square, through-hole Mini Pushbutton Switch <https://www.sparkfun.com/products/97> (COM-00097) KIT package intended for soldering kit's - only one side of pads' copper is exposed. PTH-RIGHT-ANGLE-KIT - Right-angle, through-hole Right Angle Tactile Button <https://www.sparkfun.com/products/10791> - Used on SparkFun BigTime Watch Kit <https://www.sparkfun.com/products/11734> SMD-12MM - 12mm square, surface-mount Tactile Button - SMD (12mm) <https://www.sparkfun.com/products/12993> (COM-12993) Used on SparkFun PicoBoard <https://www.sparkfun.com/products/11888> SMD-4.5MM - 4.5mm Square Trackball Switch Used on SparkFun Blackberry Trackballer Breakout <https://www.sparkfun.com/products/13169> SMD-4.6MMX2.8MM - 4.60mm x 2.80mm, surface mount Used on SparkFun SAMD21 Mini Breakout <https://www.sparkfun.com/products/13664> SMD-5.2MM, SMD-5.2-REDUNDANT - 5.2mm square, surface-mount Mini Pushbutton Switch - SMD <https://www.sparkfun.com/products/8720> (COM-08720) Used on Arduino Pro Mini <https://www.sparkfun.com/products/11114> REDUNDANT package connects both switch circuits together SMD-6.0X3.5MM - 6.0 x 3.5mm, surface mount Momentary Reset Switch SMD <https://www.sparkfun.com/products/8229> (COM-08229) SMD-6.2MM-TALL - 6.2mm square, surface mount Tactile Button - SMD (6mm) <https://www.sparkfun.com/products/12992> Used on SparkFun Digital Sandbox <https://www.sparkfun.com/products/12651> SMD-RIGHT-ANGLE - Right-angle, surface mount Used on SparkFun Block for Intel® Edison - Arduino <https://www.sparkfun.com/products/13036>; PROD_ID: SWCH-09213
SW1 = special:SW_DIP-1: DIP SWITCH
U$1 = JW5222:JW5222
U$3 = esp32-wrover-b:ESP32-WROVER
U$4 = TCS9208:TCS9208: The TCS9208 step-up switching regulator generates an output voltage of up to 6V from an input voltage as low as 1.6V. Ideal for applications where space is limited, it switches at 1.2MHz, allowing the use of tiny, low cost and low profile external components. Its internal 2A, 100mΩ NMOS switch provides high efficiency even at heavy load, while the constant frequency, current mode architecture results in low, predictable output noise that is easy to filter. Internal frequency compensation is designed to accommodate ceramic output capacitors, further reducing noise. The device features very low shutdown current of 0.5uA. The TCS9208 is available in the 6-lead SOT-23 package.